# Altium schematic sheet Schematic.SchDoc
size A4; SheetNumber: 1; SheetTotal: 1
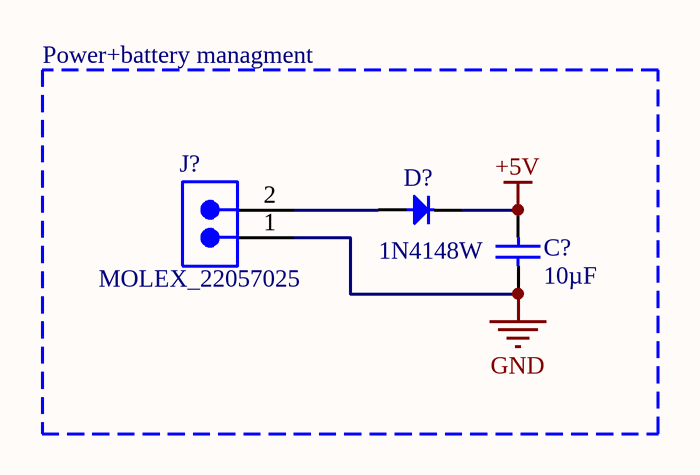
[diagram p0: Schematic.SchDoc]

## Parts
C?  value 10µF  [CAPC2012X12N]  (hidden comment: C_10u_16V_0805)
D?  1N4148W  [DIODE_SOD-123]
J?  MOLEX_22057025  [MOLEX_22057025]

## Blocks framed on the sheet
Power+battery managment: C? D? J?

## Nets
+5V: C?.2 D?.K
GND: C?.1 J?.1
NetD?_A: D?.A J?.2

## Library data of the parts
C? = CMP-001-00091-1: 10u 16V 0805 X5R Standard Capacitator; Tolerance: 20%; Capacitor Type: Ceramic; Voltage Rating: 16V; Max Operating Temperature: 85°C; Case/Package: 0805; Mounting Technology: SMT; Dielectric: X5R
D? = CMP-004-00031-1: 100V, 300mA General Purpose Diode, Vf=0.7V-1.2V; Vf: 700mV; Type: Si; Pins: 2; Case/Package: SOD-123; Mounting Technology: SMT; Imax: 300mA; Vmax: 100V
J? = CMP-002-00088-2: 2.50mm Pitch, Mini-SPOX PCB Header, Single Row, Right-Angle, Through Hole, Tin Plating, Friction Lock, 2 Circuits, Bag, 3.50mm PC Tail Length